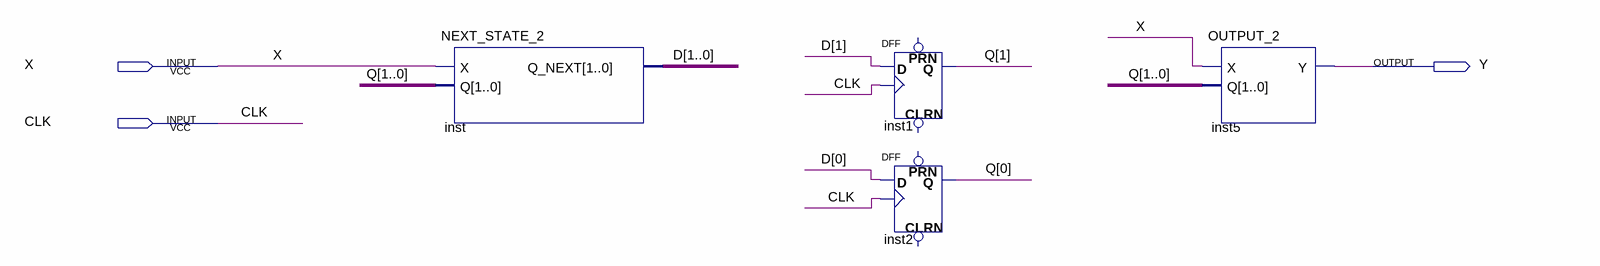
[diagram p0: schematic sheet]
// Quartus schematic LAST_NUM_Detection_2.bdf as structural Verilog: 4 symbols, 3 pins
module LAST_NUM_Detection_2 (
  input  X,
  input  CLK,
  output Y
);

  wire [1:0] D, Q;

  NEXT_STATE_2 inst (.X(X), .Q(Q), .Q_NEXT(D));
  DFF inst1 (.CLK(CLK), .D(D[1]), .Q(Q[1]));  // open: CLRN, PRN
  DFF inst2 (.CLK(CLK), .D(D[0]), .Q(Q[0]));  // open: CLRN, PRN
  OUTPUT_2 inst5 (.X(X), .Q(Q), .Y(Y));
endmodule
